# Altium schematic sheet Button.SchDoc
size A4
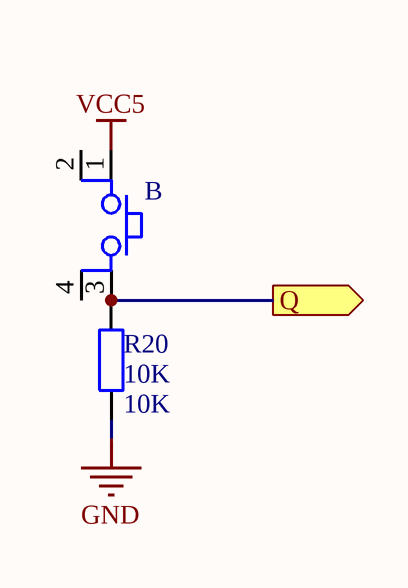
[diagram p0: Button.SchDoc]

## Parts
B  (no value)  [FP_BTN_SMD]
R20  10K  [FP_0805_RES]

## Ports
Q (out)

## Nets
GND: R20.1
VCC5: B.1
Q: B.3 R20.2 ; port Q

Not connected (* = marked no-connect by the designer): B 2 4

## Library data of the parts
B = Button: Push button; Reference: 3801305; Name: Tactile Switch; Supplier: Farnell; Link: http://hu.farnell.com/te-connectivity-alcoswitch/fsm4jsma/switch-spno-0-05a-24v-smd/dp/3801305
R20 = RES 10K: Resistor; Tolerance: 5%; Power: 125mW; Name: YAGEO (PHYCOMP)  RC0805JR-0710KL  SMD Chip Resistor, Thick Film, 10 kohm; Reference: 9234136; Supplier: Farnell; Value: 10K